# EAGLE design TouchDRO (EAGLE 7.3.0)
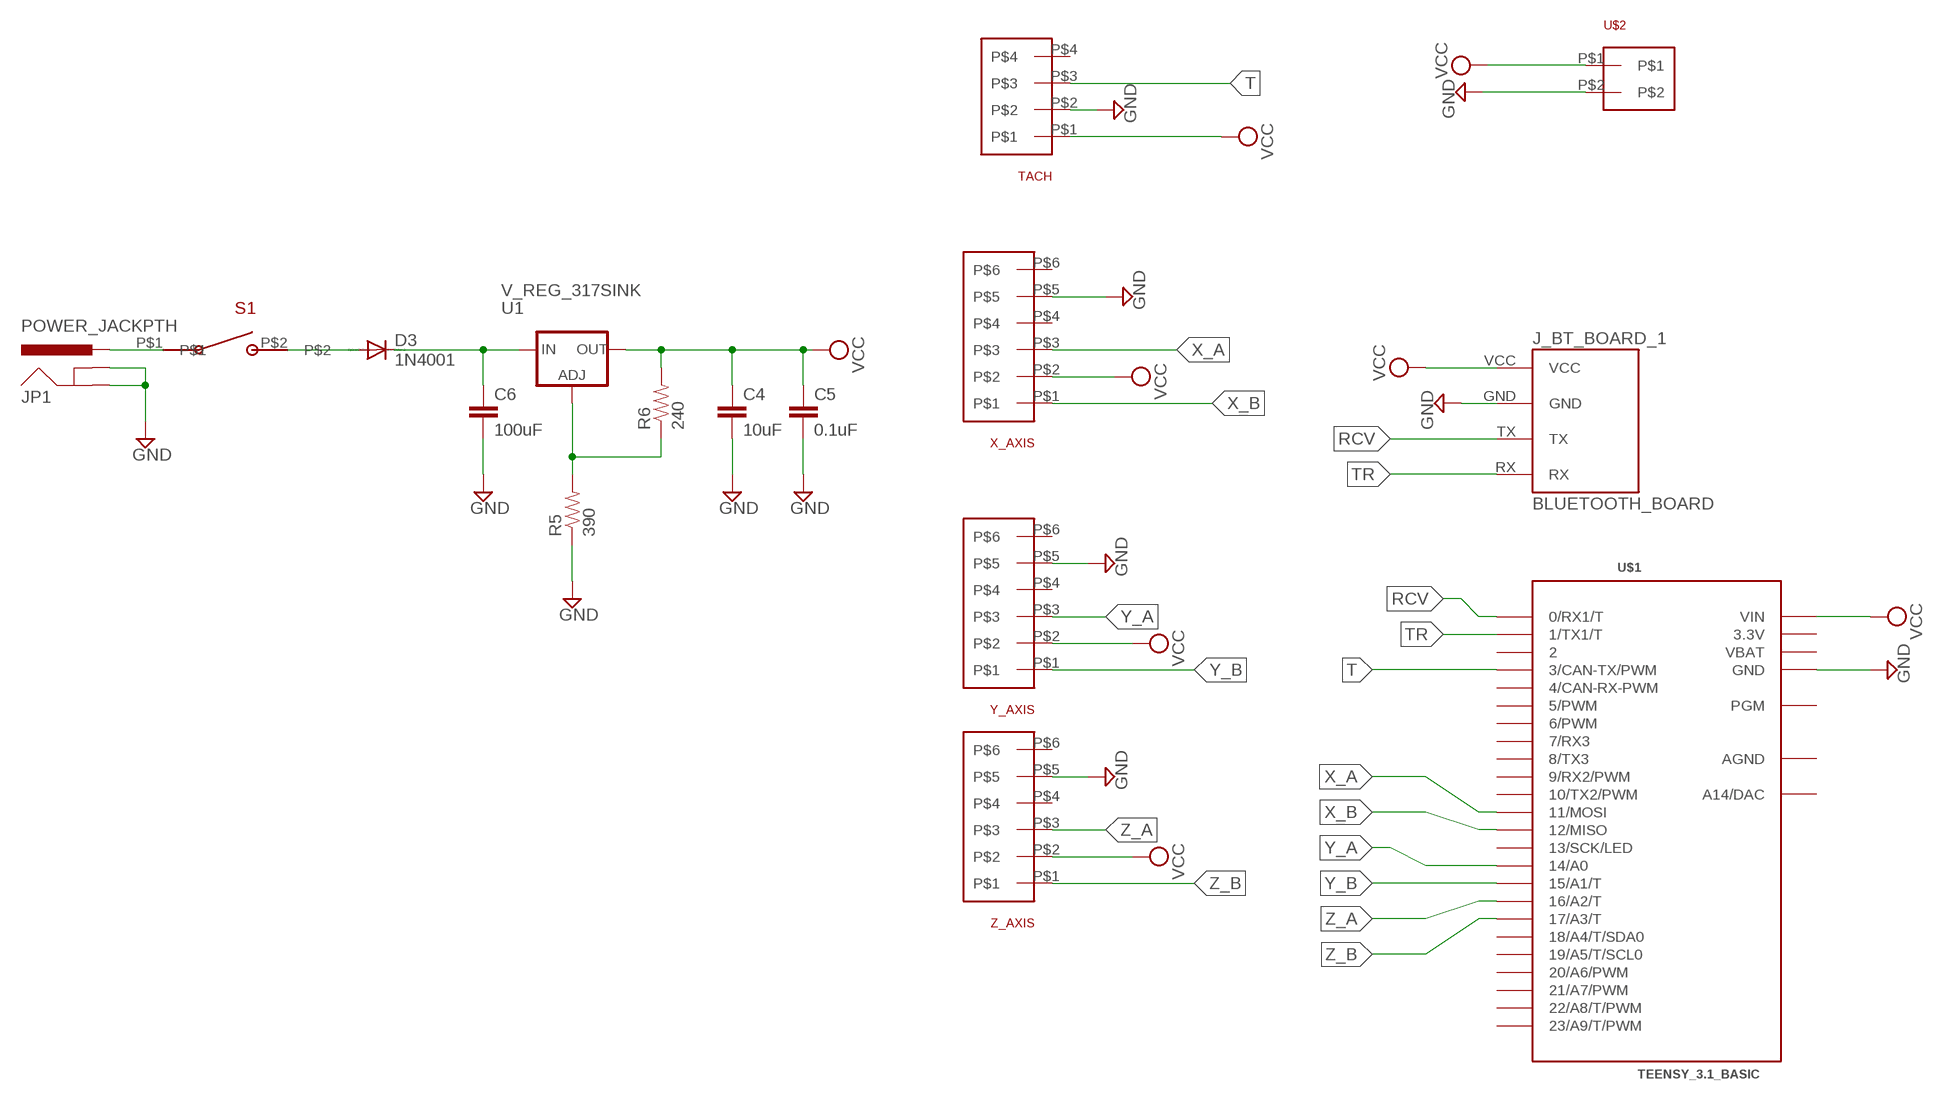
[diagram p0: schematic, sheet 1]

## Parts
C4  10uF  CAPEZ  [CAP-PTH-SMALLEZ]
C5  0.1uF  CAPEZ  [CAP-PTH-SMALLEZ]
C6  100uF  CAPEZ  [CAP-PTH-SMALLEZ]
D3  1N4001  DIODE-DO41-10  [DO41-10]
J_BT_BOARD_1  BLUETOOTH_BOARD  [BT_BOARD_FOOTPRINT]
JP1  POWER_JACKPTH  [POWER_JACK_PTH]
R5  390  RESISTOREZ  [AXIAL-0.3EZ]
R6  240  RESISTOREZ  [AXIAL-0.3EZ]
S1  R1966A  [R1966A]
TACH  KF2510_4PIN  [KF2510_4PIN]
U1  V_REG_317SINK  [TO220-ADJ]
U$1  TEENSY_3.1_BASIC  [TEENSY_3.1_BASIC]
U$2  KF2510_2PIN  [KF2510_2PIN]
X_AXIS  KF2510_6PIN  [KF2510_6PIN]
Y_AXIS  KF2510_6PIN  [KF2510_6PIN]
Z_AXIS  KF2510_6PIN  [KF2510_6PIN]

## Nets
GND: C4.2 C5.2 C6.2 J_BT_BOARD_1.GND JP1.GND JP1.GNDBREAK R5.P$1 TACH.P$2 U$1.GND U$1.GND1(GND) U$2.P$2 X_AXIS.P$5 Y_AXIS.P$5 Z_AXIS.P$5
N$6: JP1.PWR S1.P$1
N$7: R5.P$2 R6.P$1 U1.ADJ
N$9: D3.A S1.P$2
N$10: C6.1 D3.C U1.IN
RCV: J_BT_BOARD_1.TX U$1.0(0/RX1/T)
T: TACH.P$3 U$1.3(3/CAN-TX/PWM)
TR: J_BT_BOARD_1.RX U$1.1(1/TX1/T)
VCC: C4.1 C5.1 J_BT_BOARD_1.VCC R6.P$2 TACH.P$1 U1.OUT U$1.VIN U$2.P$1 X_AXIS.P$2 Y_AXIS.P$2 Z_AXIS.P$2
X_A: U$1.11(11/MOSI) X_AXIS.P$3
X_B: U$1.12(12/MISO) X_AXIS.P$1
Y_A: U$1.14/A0 Y_AXIS.P$3
Y_B: U$1.15/A1(15/A1/T) Y_AXIS.P$1
Z_A: U$1.16/A2(16/A2/T) Z_AXIS.P$3
Z_B: U$1.17/A3(17/A3/T) Z_AXIS.P$1
Unconnected: TACH.P$4 U$1.2 U$1.4(4/CAN-RX-PWM) U$1.5(5/PWM) U$1.6(6/PWM) U$1.7(7/RX3) U$1.8(8/TX3) U$1.9(9/RX2/PWM) U$1.10(10/TX2/PWM) U$1.13(13/SCK/LED) U$1.18/A4(18/A4/T/SDA0) U$1.19/A5(19/A5/T/SCL0) U$1.20/A6(20/A6/PWM) U$1.21/A7(21/A7/PWM) U$1.22/A8(22/A8/T/PWM) U$1.23/A9(23/A9/T/PWM) U$1.A14(A14/DAC) U$1.PGM X_AXIS.P$4 X_AXIS.P$6 Y_AXIS.P$4 Y_AXIS.P$6 Z_AXIS.P$4 Z_AXIS.P$6

## Power pins joined to a net without a drawn wire
3.3V: U$1.3.3V U$1.3.3V1(3.3V)
AGND: U$1.AGND
VBAT: U$1.VBAT

## Library data of the parts
C4-C6 = SparkFun-Passives:CAP: Capacitor Standard 0603 ceramic capacitor, and 0.1" leaded capacitor.
D3 = diode:DIODE-: DIODE
J_BT_BOARD_1 = Bluetooth HC-05:BLUETOOTH_BOARD: Bluetooth Board V1.05
JP1 = SparkFun-Connectors:POWER_JACK: Power Jack This is the standard 5.5mm barrel jack for power. The PTH is the most common, proven, reliable, footprint. The Slot footprint only works if the mill layer is transmitted to the PCB fab house so be warned. Mating wall wart : TOL-00298 (and others); PROD_ID: CONN-08197
R5 R6 = SparkFun-Passives:RESISTOR: Resistor Basic schematic elements and footprints for 0603, 1206, and PTH resistors.
S1 = Rocker Switch:R1966A
TACH = Connectors:KF2510_4PIN
U1 = SparkFun-PowerIC:V_REG_317: Voltage Regulator Standard LM317 adjustable voltage regulator. AOI (Adjust Output Input). Google 'LM317 Calculator' for easy to use app to get the two resistor values needed. 240/720 for 5V output. 240/390 for 3.3V output. Spark Fun Electronics SKU : COM-00527
U$1 = Teensy_3_Series_Board_v1.0:TEENSY_3.1_BASIC: Footprint for Teensy 3.1 board using all pin connections on the outer perimeter
U$2 = KF2510:KF2510_2PIN
X_AXIS Y_AXIS Z_AXIS = Connectors:KF2510_6PIN

## Board
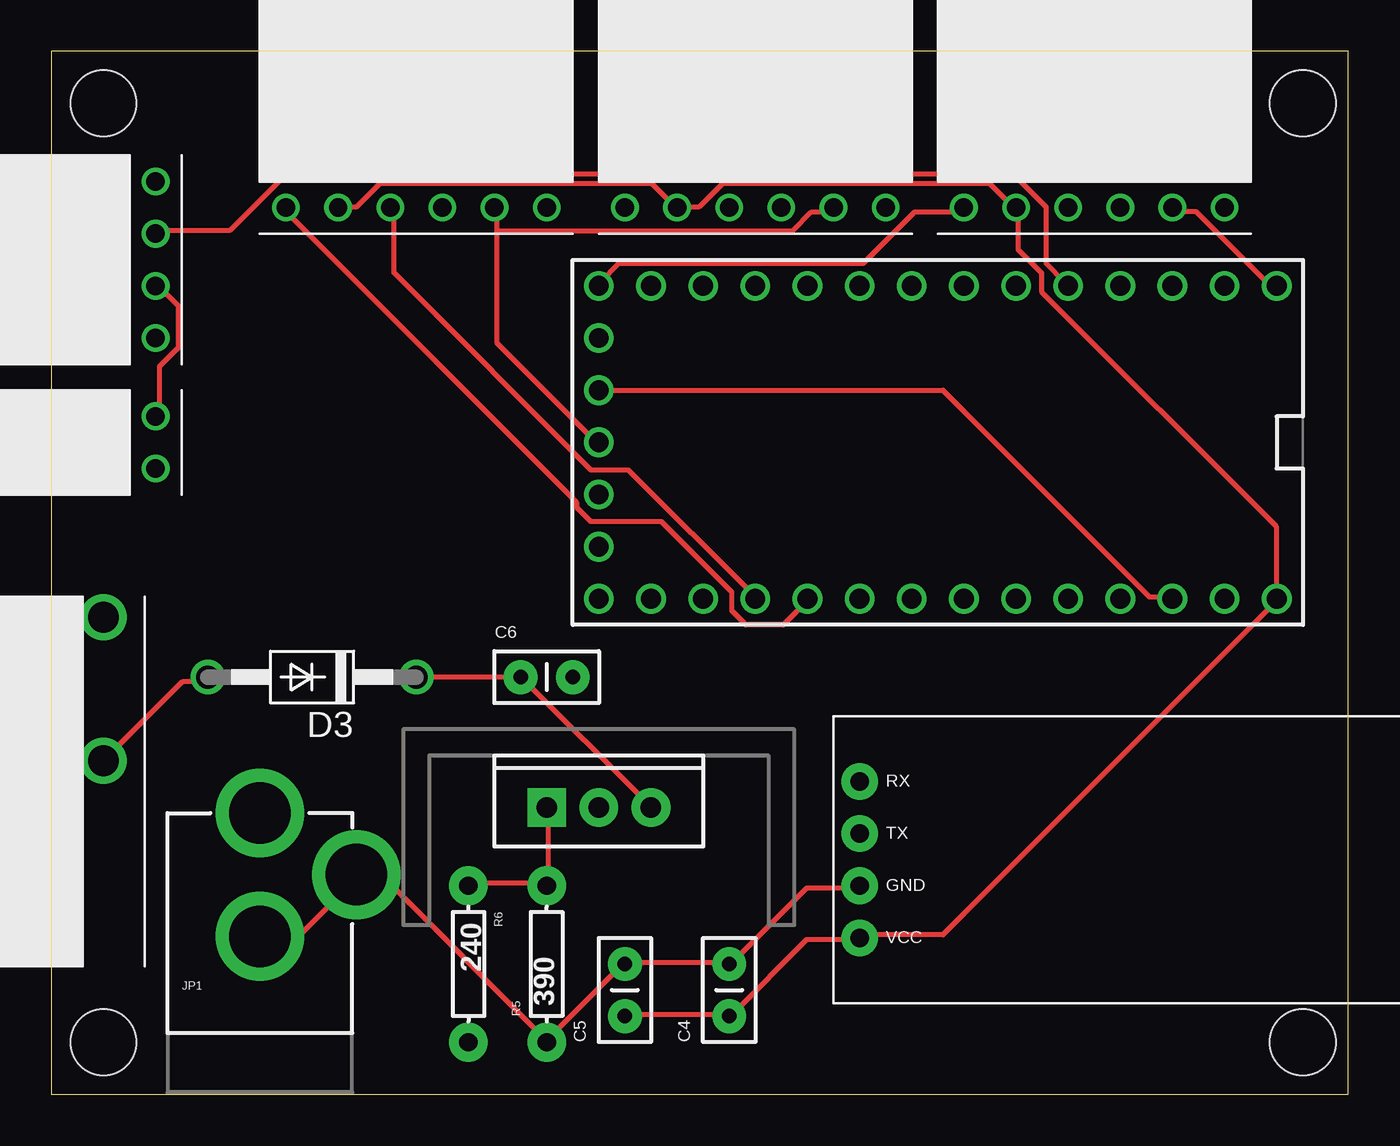
[diagram p1: board, top side]
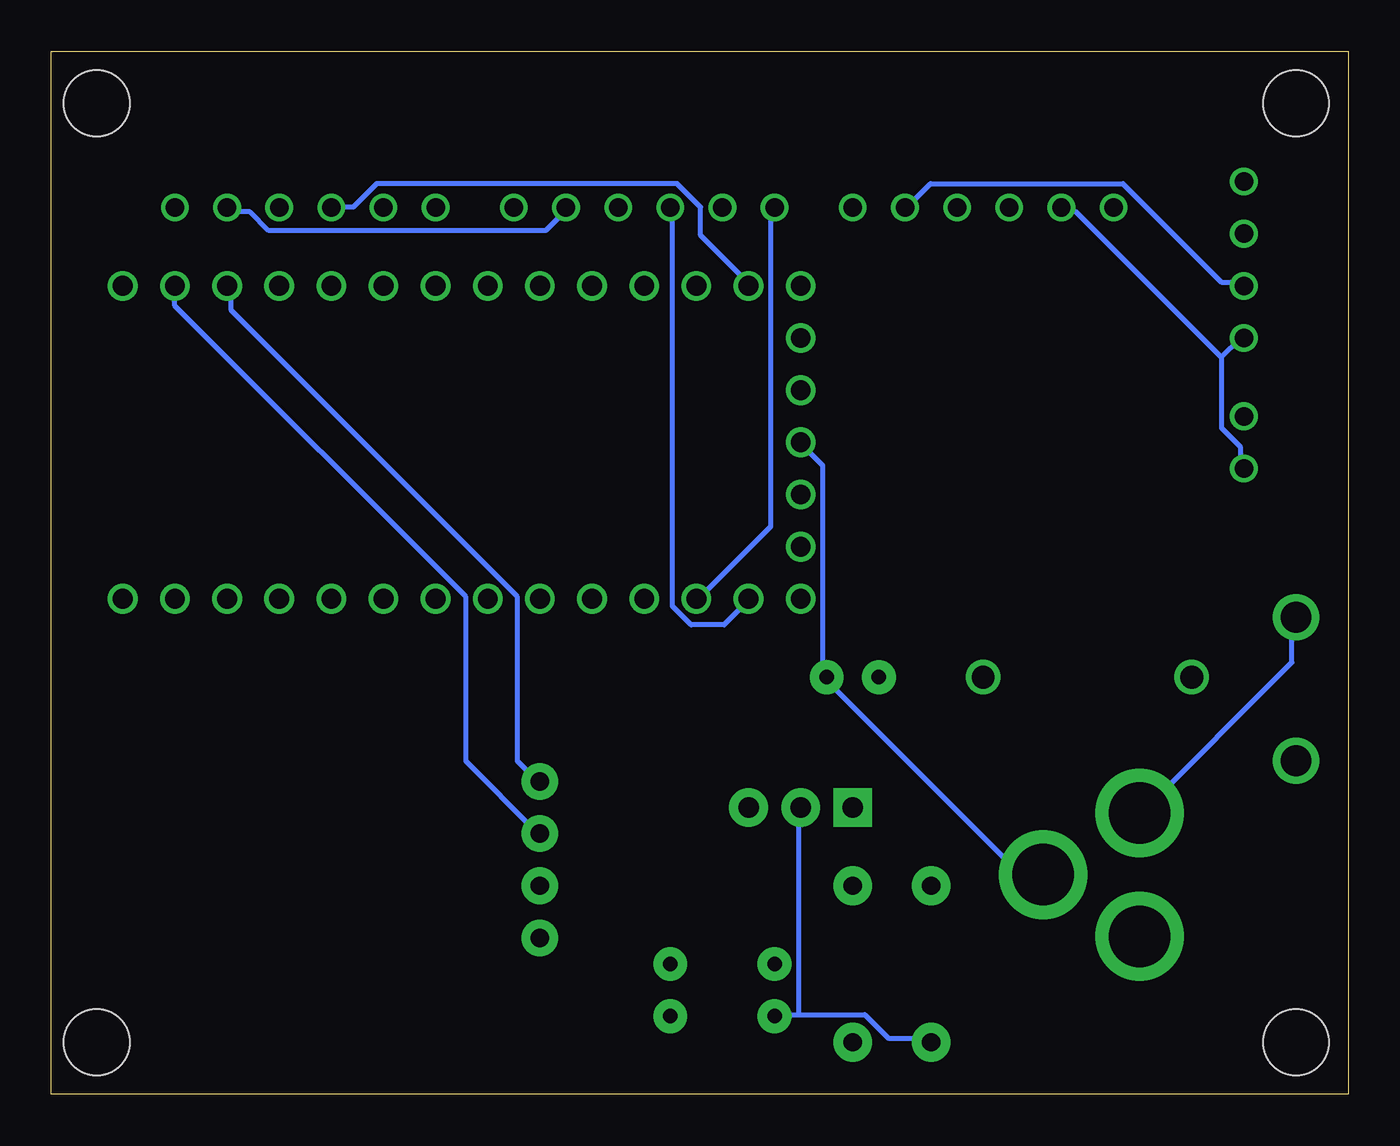
[diagram p2: board, bottom side, seen from below]

Size 63.17 x 50.79 mm. Coordinates in mm from the lower left corner, seen from the top.
Outline: 0,0 63.17,0 63.17,50.79 0,50.79 0,0
Copper layers (1*16): Top 0.0356mm / dielectric 1.5011mm / Bottom 0.0356mm
Design rules "LaenPCBOrder": minimum track width 6mil, minimum drill 13mil, track to track 6mil, track to pad 6mil, pad to pad 6mil, via to via 6mil, smd to smd 6mil, copper to edge 15mil, drill to drill 6mil, minimum pad ring 7mil, minimum via ring 7mil, stop-mask expansion 3mil, vias tented up to drill 0mil, thermal gap 10mil
Holes 3.2 mm at 2.54,48.26 60.96,48.26 2.54,2.54 60.96,2.54

### Footprints (pad centres in the part's own frame; a part is rotated, then mirrored left to right if it is on the bottom)
CAP-PTH-SMALLEZ = drill 0.7 pad 1.651: 1 0,0; 2 2.54,0
DO41-10 = drill 1.118: A 5.08,0; C -5.08,0
BT_BOARD_FOOTPRINT = drill 0.9 pad 1.778: GND -16.51,-1.27; RX -16.51,3.81; TX -16.51,1.27; VCC -16.51,-3.81
POWER_JACK_PTH = drill 2.997 pad 4.318: GND 0,7.7; GNDBREAK 4.7,10.7; PWR 0,13.7
AXIAL-0.3EZ = drill 0.9 pad 1.88: P$1 -3.81,0; P$2 3.81,0
R1966A = drill 1.5: P$1 8,0; P$2 1,0
KF2510_4PIN = drill 0.9: P$1 0,0; P$2 2.54,0; P$3 5.08,0; P$4 7.62,0
TO220-ADJ = drill 1 pad 1.88 square: ADJ -2.54,0 | drill 1 pad 1.88: IN 2.54,0; OUT 0,0
TEENSY_3.1_BASIC = drill 0.965: 0 -7.62,13.97; 1 -7.62,11.43; 2 -7.62,8.89; 3 -7.62,6.35; 3.3V 7.62,11.43; 3.3V1 -2.54,-16.51; 4 -7.62,3.81; 5 -7.62,1.27; 6 -7.62,-1.27; 7 -7.62,-3.81; 8 -7.62,-6.35; 9 -7.62,-8.89; 10 -7.62,-11.43; 11 -7.62,-13.97; 12 -7.62,-16.51; 13 7.62,-16.51; 14/A0 7.62,-13.97; 15/A1 7.62,-11.43; 16/A2 7.62,-8.89; 17/A3 7.62,-6.35; 18/A4 7.62,-3.81; 19/A5 7.62,-1.27; 20/A6 7.62,1.27; 21/A7 7.62,3.81; 22/A8 7.62,6.35; 23/A9 7.62,8.89; A14 5.08,-16.51; AGND 7.62,13.97; GND -7.62,16.51; GND1 0,-16.51; PGM 2.54,-16.51; VBAT -5.08,-16.51; VIN 7.62,16.51
KF2510_2PIN = drill 0.9: P$1 -3.81,-6.35; P$2 -1.27,-6.35
KF2510_6PIN = drill 0.9: P$1 -3.81,-6.35; P$2 -1.27,-6.35; P$3 1.27,-6.35; P$4 3.81,-6.35; P$5 6.35,-6.35; P$6 8.89,-6.35

### Placement (x,y rotation side)
C4  33.02,3.81 90 top
C5  27.94,3.81 90 top
C6  22.86,20.32 0 top
D3  12.7,20.32 180 top
J_BT_BOARD_1  55.88,11.43 0 top
JP1  10.16,0 0 top
R5  24.13,6.35 90 top
R6  20.32,6.35 270 top
S1  2.54,15.24 90 top
TACH  5.08,36.83 90 top
U1  26.67,13.97 0 top
U$1  43.18,31.75 270 top
U$2  -1.27,34.29 90 top
X_AXIS  48.26,49.53 0 top
Y_AXIS  31.75,49.53 0 top
Z_AXIS  15.24,49.53 0 top

### Tracks (layer width: path | path; a pad name or v marks a point on that pad's centre or on a via)
3.3V
  Top 0.254: U$1.3.3V1 43.43,34.29 53.49,24.23 54.41,24.23 U$1.3.3V
GND
  Top 0.254: JP1.GND 10.29,7.77 12.12,7.77 14.86,10.52 JP1.GNDBREAK 15.09,10.52 16.23,10.52 24,2.74 R5.P$1 24.23,2.74 27.89,6.4 C5.2 28.12,6.4 32.92,6.4 C4.2 33.15,6.4 36.8,10.06 39.32,10.06 J_BT_BOARD_1.GND | X_AXIS.P$5 54.63,42.98 55.78,42.98 59.21,39.55 59.66,39.55 U$1.GND | U$2.P$2 5.26,33.15 5.26,35.43 6.17,36.35 6.17,38.41 5.26,39.32 TACH.P$2 | 21.72,42.06 21.72,36.58 26.52,31.77 U$1.GND1 | 21.72,42.06 21.72,42.98 Z_AXIS.P$5 | 21.72,42.06 36.12,42.06 37.03,42.98 37.95,42.98 Y_AXIS.P$5
  Bottom 0.254: U$1.GND1 26.52,31.55 25.6,30.63 25.6,20.34 C6.2 25.38,20.12 16,10.74 15.09,10.74 JP1.GNDBREAK | TACH.P$2 5.26,39.55 6.17,39.55 10.97,44.35 20.34,44.35 21.49,43.2 Z_AXIS.P$5 | X_AXIS.P$5 54.41,42.98 53.49,42.98 52.58,42.06 39.09,42.06 38.18,42.98 Y_AXIS.P$5
N$6
  Bottom 0.254: S1.P$1 2.74,23.09 2.74,21.03 10.06,13.72 JP1.PWR
N$7
  Top 0.254: R6.P$1 20.34,10.29 24,10.29 R5.P$2 24.23,10.29 24.23,13.95 U1.ADJ
N$9
  Top 0.254: D3.A 7.54,20.12 6.4,20.12 2.74,16.46 S1.P$2
N$10
  Top 0.254: 22.86,20.34 17.83,20.34 D3.C | 22.86,20.34 29.03,14.17 U1.IN | 22.86,20.34 C6.1
RCV
  Bottom 0.254: U$1.0 57.15,38.41 42.98,24.23 42.98,16.23 39.55,12.8 J_BT_BOARD_1.TX
T
  Top 0.254: TACH.P$3 5.26,42.06 8.69,42.06 11.43,44.81 46.86,44.81 48.46,43.2 48.46,40.46 49.38,39.55 U$1.3
TR
  Bottom 0.254: U$1.1 54.41,39.32 54.41,38.18 40.46,24.23 40.46,16.23 39.55,15.32 J_BT_BOARD_1.RX
VCC
  Top 0.254: C5.1 28.12,3.89 32.92,3.89 C4.1 33.15,3.89 36.8,7.54 39.32,7.54 J_BT_BOARD_1.VCC 39.55,7.77 43.43,7.77 59.66,24 U$1.VIN 59.66,24.23 59.66,27.66 48.23,39.09 48.23,40.01 47.09,41.15 47.09,42.98 X_AXIS.P$2 46.86,43.2 45.72,44.35 32.69,44.35 31.55,43.2 30.63,43.2 Y_AXIS.P$2 30.4,43.2 29.26,44.35 16,44.35 14.86,43.2 14.17,43.2 Z_AXIS.P$2
  Bottom 0.254: 26.75,3.89 27.89,3.89 C5.1 | 26.75,3.89 23.55,3.89 22.4,2.74 20.34,2.74 R6.P$2 | 26.75,3.89 26.75,13.95 U1.OUT | 6.17,35.89 6.17,32.46 5.26,31.55 5.26,30.63 U$2.P$1 | 6.17,35.89 5.26,36.8 TACH.P$1 | 6.17,35.89 13.26,42.98 13.95,42.98 Z_AXIS.P$2
X_A
  Bottom 0.254: X_AXIS.P$3 49.38,43.2 48.46,43.2 47.32,44.35 32.69,44.35 31.55,43.2 31.55,41.83 29.26,39.55 U$1.11
X_B
  Top 0.254: X_AXIS.P$1 44.35,42.98 42.06,42.98 39.55,40.46 27.66,40.46 26.75,39.55 U$1.12
Y_A
  Bottom 0.254: Y_AXIS.P$3 32.92,42.98 32.92,23.77 32,22.86 30.4,22.86 29.26,24 U$1.14/A0
Y_B
  Bottom 0.254: Y_AXIS.P$1 28.12,42.98 28.12,27.66 31.55,24.23 U$1.15/A1
Z_A
  Top 0.254: Z_AXIS.P$3 16.69,42.98 16.69,40.01 26.29,30.4 28.12,30.4 34.29,24.23 U$1.16/A2
Z_B
  Top 0.254: Z_AXIS.P$1 11.43,42.98 25.6,28.8 25.6,28.57 26.29,27.89 29.72,27.89 33.15,24.46 33.15,23.55 33.83,22.86 35.66,22.86 36.8,24 U$1.17/A3